# Altium schematic sheet KS-WL-GW-ANA.SchDoc
size A4; CheckedBy: Fan mingjie; DrawnBy: Jason Huang; Address1: Buliding 5, No.1528; Address2: Gu Mei Rd HQ6; Address3: Shanghai, China; Address4: 20233; DocumentNumber: 1; Revision: 1; SheetNumber: 1; SheetTotal: 2
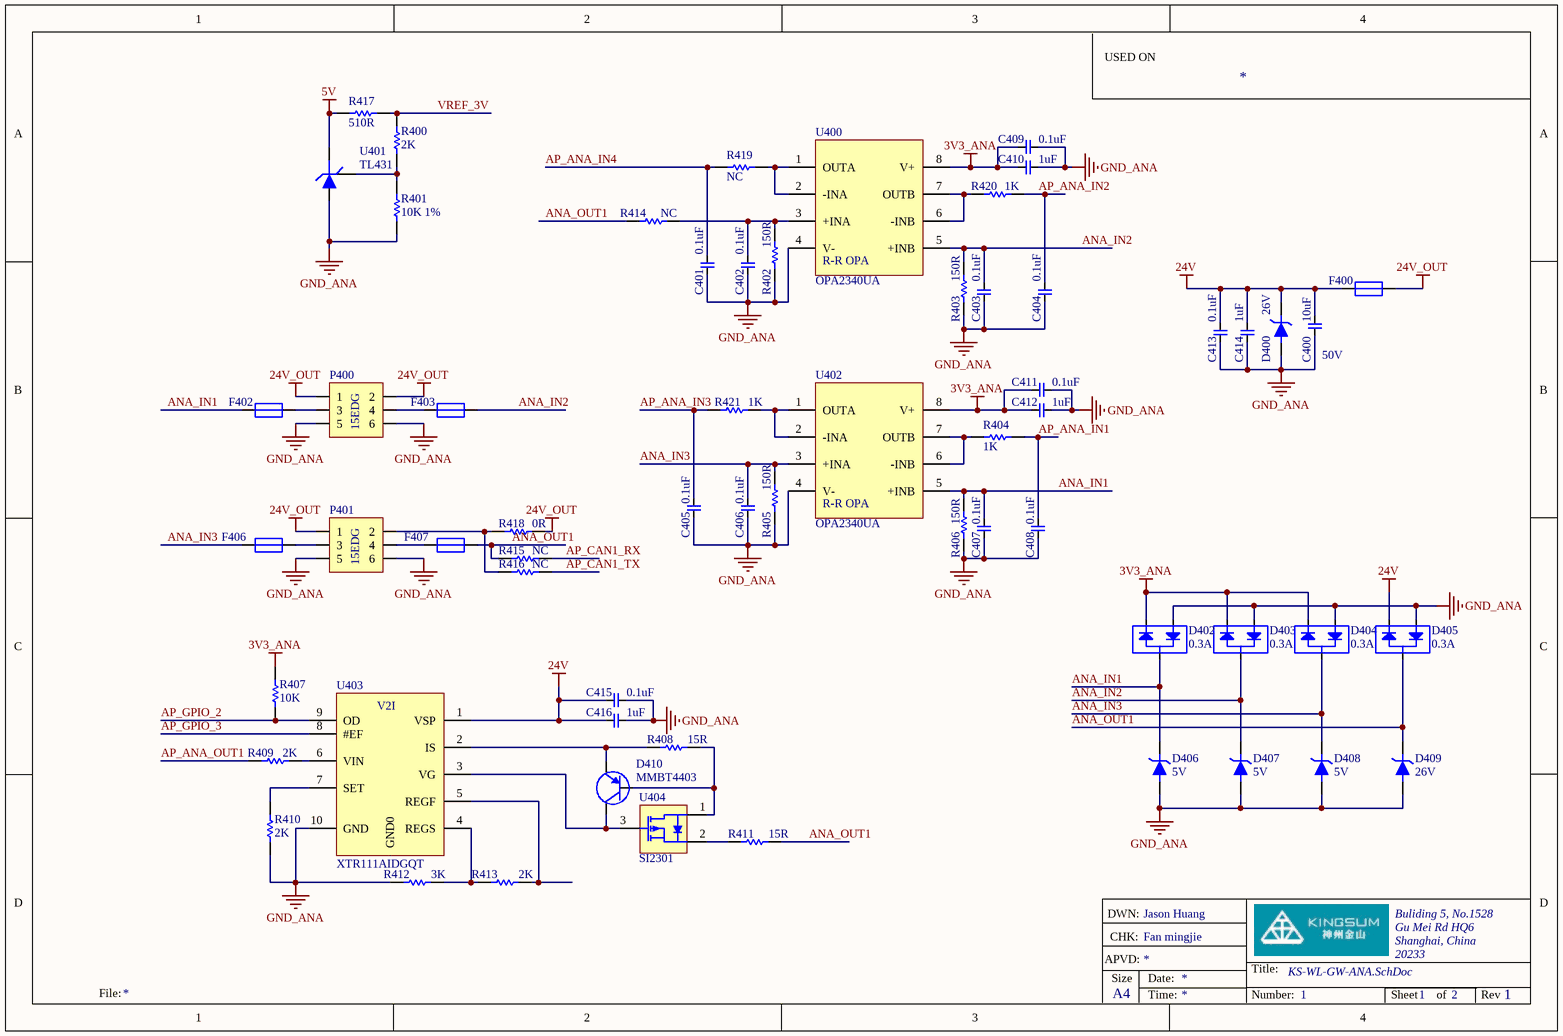
[diagram p0: KS-WL-GW-ANA.SchDoc]

## Parts
C400  10uF  Volt-Rated: 50V  [C1206_L]
C401  0.1uF  [0402 CAP]
C402  0.1uF  [0402 CAP]
C403  0.1uF  [0402 CAP]
C404  0.1uF  [0402 CAP]
C405  0.1uF  [0402 CAP]
C406  0.1uF  [0402 CAP]
C407  0.1uF  [0402 CAP]
C408  0.1uF  [0402 CAP]
C409  0.1uF  [0402 CAP]
C410  1uF  [C0805]
C411  0.1uF  [0402 CAP]
C412  1uF  [C0805]
C413  0.1uF  [0402 CAP]
C414  1uF  [C0805]
C415  0.1uF  [0402 CAP]
C416  1uF  [C0805]
D400  26V  [LC-SMB(DO-214AA)_S5]
D402  0.3A  [SOT-23-3]
D403  0.3A  [SOT-23-3]
D404  0.3A  [SOT-23-3]
D405  0.3A  [SOT-23-3]
D406  5V  [LC-SMB(DO-214AA)_S5]
D407  5V  [LC-SMB(DO-214AA)_S5]
D408  5V  [LC-SMB(DO-214AA)_S5]
D409  26V  [LC-SMB(DO-214AA)_S5]
D410  MMBT4403  [PNP]
F400  1206L025YR  [1206_FUSE]  (value not drawn)
F402  1206L025YR  [1206_FUSE]  (value not drawn)
F403  1206L025YR  [1206_FUSE]  (value not drawn)
F406  1206L025YR  [1206_FUSE]  (value not drawn)
F407  1206L025YR  [1206_FUSE]  (value not drawn)
P400  Kingsum-CONN-15EDG 3X2  [15EDG-3x2 lock]  (value not drawn)
P401  Kingsum-CONN-15EDG 3X2  [15EDG-3x2 lock]  (value not drawn)
R400  2K  [0402 Res]
R401  10K 1%  [0402 Res]
R402  150R  [0402 Res]
R403  150R  [0402 Res]
R404  1K  [0402 Res]
R405  150R  [0402 Res]
R406  150R  [0402 Res]
R407  10K  [0402 Res]
R408  15R  [0402 Res]
R409  2K  [0402 Res]
R410  2K  [0402 Res]
R411  15R  [0402 Res]
R412  3K  [0402 Res]
R413  2K  [0402 Res]
R414  NC  [0402 Res]
R415  NC  [0402 Res]
R416  NC  [0402 Res]
R417  510R  [0402 Res]
R418  0R  [0402 Res]
R419  NC  [0402 Res]
R420  1K  [0402 Res]
R421  1K  [0402 Res]
U400  OPA2340UA  [SOIC-SN8_M]
U401  TL431  [SOT-23-3]
U402  OPA2340UA  [SOIC-SN8_M]
U403  XTR111AIDGQT  [LC-MSOP-EP-10]
U404  SI2301  [SOT23_N]

## Nets
3V3_ANA: C409.2 C410.2 C411.2 C412.2 D402.2 D403.2 D404.2 R407.2 U400.8(V+) U402.8(V+)
5V: R417.1 U401.2(K)
24V: C400.2 C413.1 C414.1 C415.2 C416.2 D400.2 D405.2 F400.1 U403.1(VSP)
24V_OUT: F400.2 P400.1 P400.2 P401.1 R418.2
GND_ANA: C400.1 C401.1 C402.1 C403.1 C404.1 C405.1 C406.1 C407.1 C408.1 C409.1 C410.1 C411.1 C412.1 C413.2 C414.2 C415.1 C416.1 D400.1 D402.1 D403.1 D404.1 D405.1 D406.1 D407.1 D408.1 D409.1 P400.5 P400.6 P401.5 P401.6 R401.1 R402.1 R403.1 R405.1 R406.1 R410.1 R412.1 U400.4(V-) U401.3(A) U402.4(V-) U403.10(GND)
ANA_IN1: C407.2 D402.3 D406.2 F402.1 R406.2 U402.5(+INB)
ANA_IN2: C403.2 D403.3 D407.2 F403.2 R403.2 U400.5(+INB)
ANA_IN3: C406.2 D404.3 D408.2 F406.1 R405.2 U402.3(+INA)
ANA_OUT1: D405.3 D409.2 F407.2 R411.2 R414.1 R415.1
AP_ANA_IN1: C408.2 R404.2
AP_ANA_IN2: C404.2 R420.2
AP_ANA_IN3: C405.2 R421.1
AP_ANA_IN4: C401.2 R419.1
AP_ANA_OUT1: R409.1
AP_CAN1_RX: R415.2
AP_CAN1_TX: R416.2
AP_GPIO_2: R407.1 U403.9(OD)
AP_GPIO_3: U403.8(#EF)
VREF_3V: R400.2 R417.2
NetC402_2: C402.2 R402.2 R414.2 U400.3(+INA)
NetD410_1: D410.1(C) U403.3(VG) U404.3(D2)
NetD410_2: D410.2(B) R408.2 U404.1(S1)
NetD410_3: D410.3(E) R408.1 U403.2(IS)
NetF402_2: F402.2 P400.3
NetF403_1: F403.1 P400.4
NetF406_2: F406.2 P401.3
NetF407_1: F407.1 P401.4
NetP401_2: P401.2 R416.1 R418.1
NetR400_1: R400.1 R401.2 U401.1(REF)
NetR404_1: R404.1 U402.6(-INB) U402.7(OUTB)
NetR409_2: R409.2 U403.6(VIN)
NetR410_2: R410.2 U403.7(SET)
NetR411_1: R411.1 U404.2(G1)
NetR412_2: R412.2 R413.1 U403.4(REGS)
NetR413_2: R413.2 U403.5(REGF)
NetR419_2: R419.2 U400.1(OUTA) U400.2(-INA)
NetR420_1: R420.1 U400.6(-INB) U400.7(OUTB)
NetR421_2: R421.2 U402.1(OUTA) U402.2(-INA)

Not connected (* = marked no-connect by the designer): U403 0(GND0)

## Notes on the sheet
- USED ON
- DWN:
- APVD:
- CHK:
- Size
- Date:
- Title:
- File:
- A4
- Time:
- Number:
- Sheet
- of
- Rev
- (in symbol Kingsum-CONN-15EDG 3X2) 15EDG
- (in symbol Kingsum-IC-XTR111AIDGQT) V2I
- (in symbol Kingsum-OPA-OPA2340UA) R-R OPA

## Library data of the parts
C400 = Kingsum-C1206-10U 25V: Non-polarised capacitor; Part Rev: V; Part Description: CAPACITOR, CERAMIC CHIP, 1206 CASE, SURFACE MOUNT , 10uF +/-20% 25V, X5R; Mfr_PN: GRM31CR61H106KA12L; Manufacturer: MURATA; Tolerance: +/-20%; Signal Integrity: Cap; Option: 0; Series: MLCC; RoHS Compliant: YES; Value: 10uF; Package: C1206_L; Footprint: C1206; SPICE model: CAP; Published: 10/17/2016; Publisher: TE Connectivity; LatestRevisionDate: 08/05/2013; LatestRevisionNote: Production; ComponentLink1Description: Procurement; ComponentLink1URL: http://www.szlcsc.com/product/details_78219.html; ComponentLink3Description: Package; ComponentLink2Description: Web Page; Price: 0.258; Kingsum PN: Kingsum-C1206-10U 25V
C401-C408 = ADE-C0402-0.1U: Non-polarised capacitor; Part Rev: V; Part Description: CAPACITOR, CERAMIC CHIP, 0402 CASE, SURFACE MOUNT , 0.1 uF +/-20% 25 V, X7R; Manufacturer: MURATA; Tolerance: +/-10%; Volt-Rated: 25 V; Signal Integrity: Cap; Designator: GRM155R61E104KA87; Option: 0; TE PN: ADE-C0402-0.1U; Series: MLCC; RoHS Compliant: YES; Value: 0.1uF; Package: 0402; Footprint: 0402; SPICE model: CAP; Published: 10/14/2016; Publisher: TE Connectivity; LatestRevisionDate: 04/22/2013; LatestRevisionNote: Production; ComponentLink1Description: Datasheet; ComponentLink1URL: http://engineeringportal.tycoelectronics.com/web/engineering/part-inquiry?PartNo=1-20065-7; Mfr_PN: GRM155R61E104KA87; ComponentLink3Description: Package; ComponentLink3URL: http://www.murata.com/products/catalog/pdf/c02e.pdf; ComponentLink2Description: Web Page; ComponentLink2URL: http://dmtec.tycoelectronics.com/dmtec/servlet/DocumentLookup?type=Production+Drawing&name=20065&format=PDF; Manufacturer2: Yageo; Mfr_PN2: CC0402KRX7R8BB104
C409 C411 C413 C415 = ADE-C0402-0.1U: Non-polarised capacitor; Part Rev: V; Part Description: CAPACITOR, CERAMIC CHIP, 0402 CASE, SURFACE MOUNT , 0.1 uF +/-20% 25 V, X7R; Mfr_PN: GRM155R61E104KA87; Manufacturer: MURATA; Tolerance: +/-10%; Volt-Rated: 25 V; Signal Integrity: Cap; Option: 0; TE PN: ADE-C0402-0.1U; Series: MLCC; RoHS Compliant: YES; Value: 0.1uF; Package: 0402; Footprint: 0402; SPICE model: CAP; Published: 10/14/2016; Publisher: TE Connectivity; LatestRevisionDate: 04/22/2013; LatestRevisionNote: Production; ComponentLink1Description: Datasheet; ComponentLink1URL: http://engineeringportal.tycoelectronics.com/web/engineering/part-inquiry?PartNo=1-20065-7; ComponentLink3Description: Package; ComponentLink3URL: http://www.murata.com/products/catalog/pdf/c02e.pdf; ComponentLink2Description: Web Page; ComponentLink2URL: http://dmtec.tycoelectronics.com/dmtec/servlet/DocumentLookup?type=Production+Drawing&name=20065&format=PDF; Manufacturer2: Yageo; Mfr_PN2: CC0402KRX7R8BB104
C410 C412 C414 C416 = ADE-C0805-1uF: Non-polarised capacitor; Part Rev: V; Part Description: CAPACITOR, CERAMIC CHIP, 0805 CASE, SURFACE MOUNT , 1uF +/-10% 50 V, X7R; Mfr_PN: CC0805K_X7R9BB106; Manufacturer: Yageo; Tolerance: +/-10%; Volt-Rated: 50V; Signal Integrity: Cap; Option: 0; TE PN: ADE-C0805-1uF; Series: MLCC; RoHS Compliant: YES; Value: 1uF; Package: C0805; SPICE model: CAP; Published: 10/17/2016; Publisher: TE Connectivity; LatestRevisionDate: 04/22/2013; LatestRevisionNote: Production; ComponentLink1Description: Datasheet; ComponentLink3Description: Package; ComponentLink3URL: http://www.yageo.com/documents/recent/UPY-GPHC_X7R_6.3V-to-50V_9.pdf; ComponentLink2Description: Web Page; Price: *; Stock: *; Stock Position: *
D400 D409 = Kingsum-TVS-SMBJ26A: SMB, 26V, 600W; Part Rev: A; Manufacturer: Littelfuse; Signal Integrity: Res; Option: 0; Tmp Range: -40 to 85; Kingsum_PN: Kingsum-TVS-SMBJ26A; ComponentLink2Description: Web Page; Series: FUSE; Part Description: SMB, 26V, 600W; Mfr_PN: SMBJ26A; ComponentLink3URL: http://www.szlcsc.com/product/details_125093.html; RoHS Compliant: YES; Value: 600W; Package: SMB; Volt-Rated: 26V; Footprint: SMB; SPICE model: RESISTOR; Published: 07/05/2013; Publisher: TE Connectivity; LatestRevisionDate: 11/15/2012; LatestRevisionNote: Production; ComponentLink1Description: Datasheet; ComponentLink3Description: Procurement; Price: 0.0
D402-D405 = Kingsum-DIODES-BAT54S: SOT-23-3, 30V,200mA, Serial A K; Mfr_PN: BAT54S; Manufacturer: JCST; Power-Rated: 255mW; Option: 0; Tmp Range: -5 to 155; Kingsum_PN: Kingsum-DIODES-BAT54S; Part Rev: A; Series: Diode; Part Description: SOT-23-3, 30V,200mA, Serial A K; ComponentLink3URL: http://www.szlcsc.com/product/details_9087.html; RoHS Compliant: YES; Value: 0.3A; Package: SOT-23-3; Volt-Rated: 30 V; SPICE model: Diode; Designator: BAT54S; Published: 24/02/2014; LatestRevisionDate: 27/02/2013; LatestRevisionNote: Production; ComponentLink3Description: Procurement; Price: 0.09
D406-D408 = Kingsum-TVS-SMBJ5A: SMB, 5V, 600W; Part Rev: A; Mfr_PN: SMBJ5A; Manufacturer: Littelfuse; Signal Integrity: Res; Option: 0; Tmp Range: -40 to 85; Kingsum_PN: Kingsum-TVS-SMBJ5A; ComponentLink2Description: Web Page; Series: FUSE; Part Description: SMB, 5V, 600W; ComponentLink3URL: http://www.szlcsc.com/product/details_100777.html; RoHS Compliant: YES; Value: 600W; Package: SMB; Volt-Rated: 5V; Footprint: SMB; SPICE model: RESISTOR; Published: 07/05/2013; Publisher: TE Connectivity; LatestRevisionDate: 11/15/2012; LatestRevisionNote: Production; ComponentLink1Description: Datasheet; ComponentLink3Description: Procurement
D410 = ADE-PNP Transistor-MMBT4403: PNP Transistor, MMBT4403; Manufacturer: DOIDES; V-rated: VCEO -40V; VEBO 6V; Option: 0; TE_PN: ADE-PNP Transistor-MMBT4403; ComponentLink2Description: Web Page; Series: Transistor; Part Description: PNP Transistor, MMBT4403; Mfr_PN: MMBT4403; RoHS Compliant: YES; Package: SOT323; Designator: MMBT4403; Published: 23/01/2015; Publisher: TE Connectivity; LatestRevisionNote: Production; ComponentLink1URL: http://www.diodes.com/_files/datasheets/ds30058.pdf; ComponentLink1Description: Datasheet; ComponentLink3Description: Package
F400 F402 F403 F406 F407 = Kingsum-FUSE-1206L025YR: 1206 Fuse 0.25A ,16V; Part Rev: A; Manufacturer: Littelfuse; Value: 0.25; Signal Integrity: Res; Option: 0; Tmp Range: -40 to 85; Kingsum_PN: Kingsum-FUSE-1206L025YR; ComponentLink2Description: Web Page; Series: FUSE; Part Description: 1206 Fuse 0.25A; Mfr_PN: 1206L025YR; ComponentLink3URL: http://www.szlcsc.com/product/details_100777.html; RoHS Compliant: YES; Package: 1206 FUSE; Volt-Rated: 16V; Footprint: 1206 FUSE; SPICE model: RESISTOR; Published: 07/05/2013; Publisher: TE Connectivity; LatestRevisionDate: 11/15/2012; LatestRevisionNote: Production; ComponentLink1Description: Datasheet; ComponentLink3Description: Procurement
P400 P401 = Kingsum-CONN-15EDG 3X2: Header, 6pin, 3x2; Manufacturer: 奥斯电子有限公司; Mfr_PN: 15EDGKDM-3.81-3P Set; Part Description: Header 15EDG Right angle 3.81mm 2X3P; Option: 0; Publisher: Belle 13600268167; ComponentLink2Description: Web Page; ComponentLink1Description: Datasheet; ComponentLink3Description: Package; Price: 6.48; ComponentLink3URL: https://item.taobao.com/item.htm?spm=a1z0d.6639537.1997196601.27.7be0196qmpE2w&id=530250136705
R400 R409 R410 R413 = ADE-R0402-2K: RESISTOR  Normal; Part Rev: A; Part Description: RESISTOR, CHIP, THICK FILM, SURGE CURRENT, 0402 CASE, 1/16 W, 50 V , 2K OHMS +/-5%, +/-100 PPM/DEG C, TIN TERMINATION; Mfr_PN: RC0402JR-7D2KL; Manufacturer: YAGEO; Precision: +/-5%; Volt-Rated: 50 V; Power-Rated: 1/16 W; Signal Integrity: Res; Option: 0; TE_PN: ADE-R0402-2K; ComponentLink2Description: Web Page; ComponentLink2URL: http://dmtec.tycoelectronics.com/dmtec/servlet/DocumentLookup?type=Production+Drawing&name=1900457&format=PDF; Series: General Purpose Chip Resistors; ComponentLink3URL: http://www.yageo.com/documents/recent/PYu-RC0402_51_RoHS_L_6_r.pdf; RoHS Compliant: YES; Value: 2K; Package: 0402; Footprint: kOA1E-0402; SPICE model: RESISTOR; Published: 25/04/2013; Publisher: TE Connectivity; LatestRevisionDate: 11/15/2012; LatestRevisionNote: Production; ComponentLink1URL: http://engineeringportal.tycoelectronics.com/web/engineering/part-inquiry?PartNo=1900457-1; ComponentLink1Description: Datasheet; ComponentLink3Description: Package
  R409 R410 R413: Designator: RC0402JR-7D2KL
R401 = ADE-R0402-10K-1%: RESISTOR  Normal; Part Rev: A; Part Description: RESISTOR, CHIP, THICK FILM, SURGE CURRENT, 0402 CASE, 1/16 W, 50 V , 10K OHMS +/-1%, +/-100 PPM/DEG C, TIN TERMINATION; Mfr_PN: RC0402FR-0710KL; Manufacturer: YAGEO; Precision: +/-1%; Volt-Rated: 50 V; Power-Rated: 1/16 W; Signal Integrity: Res; Option: 0; TE_PN: ADE-R0402-10K; ComponentLink2Description: Web Page; ComponentLink2URL: http://dmtec.tycoelectronics.com/dmtec/servlet/DocumentLookup?type=Production+Drawing&name=1900457&format=PDF; Series: General Purpose Chip Resistors; ComponentLink3URL: http://www.yageo.com/documents/recent/PYu-RC0402_51_RoHS_L_6_r.pdf; RoHS Compliant: YES; Value: 10K 1%; Package: 0402; Footprint: kOA1E-0402; SPICE model: RESISTOR; Published: 25/04/2013; Publisher: TE Connectivity; LatestRevisionDate: 25/04/2013; LatestRevisionNote: Production; ComponentLink1URL: http://engineeringportal.tycoelectronics.com/web/engineering/part-inquiry?PartNo=1900457-1; ComponentLink1Description: Datasheet; ComponentLink3Description: Package
R402 R403 R405 R406 = ADE-R0402-150R: RESISTOR  Normal; Part Rev: A; Part Description: RESISTOR, CHIP, THICK FILM, SURGE CURRENT, 0402 CASE, 1/16 W, 50 V , 150R OHMS +/-5%, +/-100 PPM/DEG C, TIN TERMINATION; Mfr_PN: RC0402JR-7D150RL; Manufacturer: YAGEO; Precision: +/-5%; Volt-Rated: 50 V; Power-Rated: 1/16 W; Signal Integrity: Res; Option: 0; TE_PN: ADE-R0402-150R; ComponentLink2Description: Web Page; ComponentLink2URL: http://dmtec.tycoelectronics.com/dmtec/servlet/DocumentLookup?type=Production+Drawing&name=1900457&format=PDF; Series: General Purpose Chip Resistors; ComponentLink3URL: http://www.yageo.com/documents/recent/PYu-RC0402_51_RoHS_L_6_r.pdf; RoHS Compliant: YES; Value: 150R; Package: 0402; Footprint: kOA1E-0402; SPICE model: RESISTOR; Published: 25/04/2013; Publisher: TE Connectivity; LatestRevisionDate: 25/04/2013; LatestRevisionNote: Production; ComponentLink1URL: http://engineeringportal.tycoelectronics.com/web/engineering/part-inquiry?PartNo=1900457-1; ComponentLink1Description: Datasheet; ComponentLink3Description: Package
R404 = ADE-R0402-1k: RESISTOR  Normal; Part Rev: A; Part Description: RESISTOR, CHIP, THICK FILM, SURGE CURRENT, 0402 CASE, 1/16 W, 50 V , 1K OHMS +/-5%, +/-100 PPM/DEG C, TIN TERMINATION; Mfr_PN: RC0402JR-7D1KL; Manufacturer: YAGEO; Precision: +/-5%; Volt-Rated: 50 V; Power-Rated: 1/16 W; Signal Integrity: Res; Option: 0; TE_PN: ADE-R0402-1K; ComponentLink2Description: Web Page; ComponentLink2URL: http://dmtec.tycoelectronics.com/dmtec/servlet/DocumentLookup?type=Production+Drawing&name=1900457&format=PDF; Series: General Purpose Chip Resistors; ComponentLink3URL: http://www.yageo.com/documents/recent/PYu-RC0402_51_RoHS_L_6_r.pdf; RoHS Compliant: YES; Value: 1K; Package: 0402; Footprint: kOA1E-0402; SPICE model: RESISTOR; Published: 25/04/2013; Publisher: TE Connectivity; LatestRevisionDate: 11/15/2012; LatestRevisionNote: Production; ComponentLink1URL: http://engineeringportal.tycoelectronics.com/web/engineering/part-inquiry?PartNo=1900457-1; ComponentLink1Description: Datasheet; ComponentLink3Description: Package
R407 = ADE-R0402-10K: RESISTOR  Normal; Part Rev: A; Part Description: RESISTOR, CHIP, THICK FILM, SURGE CURRENT, 0402 CASE, 1/16 W, 50 V , 10K OHMS +/-5%, +/-100 PPM/DEG C, TIN TERMINATION; Mfr_PN: RC0402JR-7D10KL; Manufacturer: YAGEO; Precision: +/-5%; Volt-Rated: 50 V; Power-Rated: 1/16 W; Signal Integrity: Res; Option: 0; TE_PN: ADE-R0402-10K; ComponentLink2Description: Web Page; ComponentLink2URL: http://dmtec.tycoelectronics.com/dmtec/servlet/DocumentLookup?type=Production+Drawing&name=1900457&format=PDF; Series: General Purpose Chip Resistors; ComponentLink3URL: http://www.yageo.com/documents/recent/PYu-RC0402_51_RoHS_L_6_r.pdf; RoHS Compliant: YES; Value: 10K; Package: 0402; Footprint: kOA1E-0402; SPICE model: RESISTOR; Designator: RC0402JR-7D10KL; Published: 25/04/2013; Publisher: TE Connectivity; LatestRevisionDate: 25/04/2013; LatestRevisionNote: Production; ComponentLink1URL: http://engineeringportal.tycoelectronics.com/web/engineering/part-inquiry?PartNo=1900457-1; ComponentLink1Description: Datasheet; ComponentLink3Description: Package
R408 R411 = ADE-R0402-15K: RESISTOR  Normal; Part Rev: A; Part Description: RESISTOR, CHIP, THICK FILM, SURGE CURRENT, 0402 CASE, 1/16 W, 50 V , 15K OHMS +/-5%, +/-100 PPM/DEG C, TIN TERMINATION; Mfr_PN: RC0402JR-7D15KL; Manufacturer: YAGEO; Value: 15K; Precision: +/-5%; Volt-Rated: 50 V; Power-Rated: 1/16 W; Signal Integrity: Res; Option: 0; TE_PN: ADE-R0402-15K; ComponentLink2Description: Web Page; ComponentLink2URL: http://dmtec.tycoelectronics.com/dmtec/servlet/DocumentLookup?type=Production+Drawing&name=1900457&format=PDF; Series: General Purpose Chip Resistors; ComponentLink3URL: http://www.yageo.com/documents/recent/PYu-RC0402_51_RoHS_L_6_r.pdf; RoHS Compliant: YES; Package: 0402; Footprint: kOA1E-0402; SPICE model: RESISTOR; Designator: RC0402JR-7D15KL; Published: 25/04/2013; Publisher: TE Connectivity; LatestRevisionDate: 25/04/2013; LatestRevisionNote: Production; ComponentLink1URL: http://engineeringportal.tycoelectronics.com/web/engineering/part-inquiry?PartNo=1900457-1; ComponentLink1Description: Datasheet; ComponentLink3Description: Package
R412 = ADE-R0402-3K: RESISTOR  Normal; Part Rev: A; Part Description: RESISTOR, CHIP, THICK FILM, SURGE CURRENT, 0402 CASE, 1/16 W, 50 V , 2K7 OHMS +/-5%, +/-100 PPM/DEG C, TIN TERMINATION; Mfr_PN: RC0402JR-7D3KL; Manufacturer: YAGEO; Precision: +/-5%; Volt-Rated: 50 V; Power-Rated: 1/16 W; Signal Integrity: Res; Option: 0; TE_PN: ADE-R0402-3K; ComponentLink2Description: Web Page; ComponentLink2URL: http://dmtec.tycoelectronics.com/dmtec/servlet/DocumentLookup?type=Production+Drawing&name=1900457&format=PDF; Series: General Purpose Chip Resistors; ComponentLink3URL: http://www.yageo.com/documents/recent/PYu-RC0402_51_RoHS_L_6_r.pdf; RoHS Compliant: YES; Value: 3K; Package: 0402; Footprint: kOA1E-0402; SPICE model: RESISTOR; Designator: RC0402JR-7D3KL; Published: 25/04/2013; Publisher: TE Connectivity; LatestRevisionDate: 11/15/2012; LatestRevisionNote: Production; ComponentLink1URL: http://engineeringportal.tycoelectronics.com/web/engineering/part-inquiry?PartNo=1900457-1; ComponentLink1Description: Datasheet; ComponentLink3Description: Package
R414-R416 R419 = ADE-R0402-NC: RESISTOR  Normal; Part Rev: A; Part Description: RESISTOR, CHIP, THICK FILM, NC; Manufacturer: YAGEO; Precision: +/-5%; Power-Rated: 1/16 W; Signal Integrity: Res; Option: 0; TE_PN: -; ComponentLink2Description: Web Page; ComponentLink2URL: http://dmtec.tycoelectronics.com/dmtec/servlet/DocumentLookup?type=Production+Drawing&name=1900457&format=PDF; Series: General Purpose Chip Resistors; Mfr_PN: NC; ComponentLink3URL: http://www.yageo.com/documents/recent/PYu-RC0402_51_RoHS_L_6_r.pdf; RoHS Compliant: YES; Value: NC; Package: 0402; Volt-Rated: -; Footprint: kOA1E-0402; SPICE model: RESISTOR; Published: 25/04/2013; Publisher: TE Connectivity; LatestRevisionDate: 11/15/2012; LatestRevisionNote: Production; ComponentLink1URL: http://engineeringportal.tycoelectronics.com/web/engineering/part-inquiry?PartNo=1900457-1; ComponentLink1Description: Datasheet; ComponentLink3Description: Package
R417 = ADE-R0402-510R: RES, Carbon Film SMT0402, 510 Ohm, 5%, 1/16W; Part Rev: A; Mfr_PN: RC0402JR-7D510RL; Manufacturer: YAGEO; Precision: +/-5%; Volt-Rated: 50 V; Option: 0; TE_PN: ADE-R0402-510R; ComponentLink2Description: Web Page; ComponentLink2URL: http://dmtec.tycoelectronics.com/dmtec/servlet/DocumentLookup?type=Production+Drawing&name=1900457&format=PDF; Series: General Purpose Chip Resistors; Part Description: RES, Carbon Film SMT0402, 510 Ohm, 5%, 1/16W; ComponentLink3URL: http://www.yageo.com/documents/recent/PYu-RC0402_51_RoHS_L_6_r.pdf; RoHS Compliant: YES; Value: 510R; Package: 0402; Power-Rated: 1/16 W; Footprint: 0402; SPICE model: RESISTOR; Signal Integrity: Res; Designator: RC0402JR-7D510RL; Published: 25/04/2013; Publisher: TE Connectivity; LatestRevisionDate: 25/04/2013; LatestRevisionNote: Production; ComponentLink1URL: http://engineeringportal.tycoelectronics.com/web/engineering/part-inquiry?PartNo=1900457-1; ComponentLink1Description: Datasheet; ComponentLink3Description: Package
R418 = ADE-R0402-0R: RESISTOR  Normal; Part Rev: A; Part Description: RESISTOR, CHIP, THICK FILM, SURGE CURRENT, 0402 CASE, 1/16 W, 50V, 1 A , 0 OHMS +/-5%, +/-200 PPM/DEG C, TIN TERMINATION; Mfr_PN: RC0402JR-7D0RL; Manufacturer: YAGEO; Precision: +/-5%; Volt-Rated: 50 V; Power-Rated: 1/16 W; Signal Integrity: Res; Option: 0; TE_PN: ADE-R0402-0R; ComponentLink2Description: Web Page; ComponentLink2URL: http://dmtec.tycoelectronics.com/dmtec/servlet/DocumentLookup?type=Production+Drawing&name=1900457&format=PDF; Series: General Purpose Chip Resistors; ComponentLink3URL: http://www.yageo.com/documents/recent/PYu-RC0402_51_RoHS_L_6_r.pdf; RoHS Compliant: YES; Value: 0R; Package: 0402; Footprint: kOA1E-0402; SPICE model: RESISTOR; Designator: RC0402JR-7D0RL; Published: 25/04/2013; Publisher: TE Connectivity; LatestRevisionDate: 11/15/2012; LatestRevisionNote: Production; ComponentLink1URL: http://engineeringportal.tycoelectronics.com/web/engineering/part-inquiry?PartNo=1900457-1; ComponentLink1Description: Datasheet; ComponentLink3Description: Package
R420 R421 = ADE-R0402-1K: RESISTOR  Normal; Part Rev: A; Part Description: RESISTOR, CHIP, THICK FILM, SURGE CURRENT, 0402 CASE, 1/16 W, 50 V , 1K OHMS +/-5%, +/-100 PPM/DEG C, TIN TERMINATION; Mfr_PN: RC0402JR-7D1KL; Manufacturer: YAGEO; Precision: +/-5%; Volt-Rated: 50 V; Power-Rated: 1/16 W; Signal Integrity: Res; Option: 0; TE_PN: ADE-R0402-1K; ComponentLink2Description: Web Page; ComponentLink2URL: http://dmtec.tycoelectronics.com/dmtec/servlet/DocumentLookup?type=Production+Drawing&name=1900457&format=PDF; Series: General Purpose Chip Resistors; ComponentLink3URL: http://www.yageo.com/documents/recent/PYu-RC0402_51_RoHS_L_6_r.pdf; RoHS Compliant: YES; Value: 1K; Package: 0402; Footprint: kOA1E-0402; SPICE model: RESISTOR; Designator: RC0402JR-7D1KL; Published: 25/04/2013; Publisher: TE Connectivity; LatestRevisionDate: 11/15/2012; LatestRevisionNote: Production; ComponentLink1URL: http://engineeringportal.tycoelectronics.com/web/engineering/part-inquiry?PartNo=1900457-1; ComponentLink1Description: Datasheet; ComponentLink3Description: Package
U400 U402 = Kingsum-OPA-OPA2340UA: SINGLE-SUPPLY, RAIL-TO-RAIL OPERATIONAL AMPLIFIERS; Manufacturer: TI; Option: 0; Tmp Range: -40 to 85; Publisher: FMJ; ComponentLink1Description: Datasheet; ComponentLink1URL: Datasheet/OPA; ComponentLink2Description: Web Page; ComponentLink3Description: Procurement; ComponentLink3URL: http://www.szlcsc.com/product/details_55655.html; Code_IPC: *; Code_JEITA: *; Footprint: SO8; LatestRevisionNote: PRODUCTION; Mfr_PN: OPA2340UA; Package: SO8; Part Rev: *; Published: 10/14/2016; RoHS Compliant: YES; Kingsum PN: Kingsum-OPA-OPA2340UA; Part Description: SINGLE-SUPPLY, RAIL-TO-RAIL OPERATIONAL AMPLIFIERS; Price: 10; Stock: *; Stock Position: *
U401 = Kingsum-ARS-TL431: Adjustable Accurate Reference Source; Manufacturer: SK; Option: 0; Tmp Range: -65 to 150; Publisher: FMJ; ComponentLink1Description: Datasheet; ComponentLink1URL: Datasheet/ESD; ComponentLink2Description: Web Page; ComponentLink3Description: Procurement; ComponentLink3URL: http://www.szlcsc.com/product/details_112805.html; Code_IPC: *; Code_JEITA: *; Footprint: SOT23; LatestRevisionNote: PRODUCTION; Mfr_PN: TL431; Package: SOT23; Part Rev: *; Published: 10/14/2016; RoHS Compliant: YES; Kingsum PN: Kingsum-ARS-TL431; Part Description: Adjustable Accurate Reference Source; Price: 1; Stock: *; Stock Position: *
U403 = Kingsum-IC-XTR111AIDGQT: Precision Voltage-to-Current  Converter/Transmitter; Manufacturer: TI; Option: 0; Tmp Range: -40 to 85; Publisher: FMJ; ComponentLink1Description: Datasheet; ComponentLink1URL: Datasheet/OPA; ComponentLink2Description: Web Page; ComponentLink3Description: Procurement; ComponentLink3URL: http://www.szlcsc.com/product/details_55655.html; Code_IPC: *; Code_JEITA: *; Designator: XTR111AIDGQT; Footprint: SO8; LatestRevisionNote: PRODUCTION; Mfr_PN: XTR111AIDGQT; Package: SO8; Part Rev: *; Published: 10/14/2016; RoHS Compliant: YES; Kingsum PN: Kingsum-IC-XTR111AIDGQT; Part Description: Precision Voltage-to-Current  Converter/Transmitter; Price: 10; Stock: *; Stock Position: *
U404 = ADE-PMOS-SI2301: -20V -2.8A,PMOS, 1.25W; Part Description: -20V -2.8A,  PMOS, SOT23; Part Rev: B; Manufacturer: Micro Commercial Components; PowerWise: N; LatestResvisionNote: PRODUCTION; Option: 0; Published: 27/03/2014; DatasheetVersion: 01-01-2011; PackageReference: SOT23; Publisher: TE Connectivity; PackageDescription: Name	Type	Description	Vault	Item Revision; PartNumber: SI2301; RoHS: O; PinCount: 6; DigiKeyPartNumber: SI2301; ComponentLink1Description: Datasheet; ComponentLink1URL: http://www.mccsemi.com/up_pdf/SI2301(SOT-23).pdf; ComponentLink2Description: Web Page; ComponentLink2URL: http://www.mccsemi.com/up_pdf/SI2301(SOT-23).pdf; ComponentLink3Description: Package; ComponentLink3URL: http://www.mccsemi.com/up_pdf/SI2301(SOT-23).pdf; Designator: SI2301; LatestRevisionDate: 01/01/2013; Mfr_PN: SI2301; Package: SOT-23; RoHS Compliant: YES; Series: MOS; TE PN: ADE-PMOS-SI2301; LatestRevisionNote: Production